# EAGLE design tick-display-mk-4-mini (EAGLE 6.5.0)
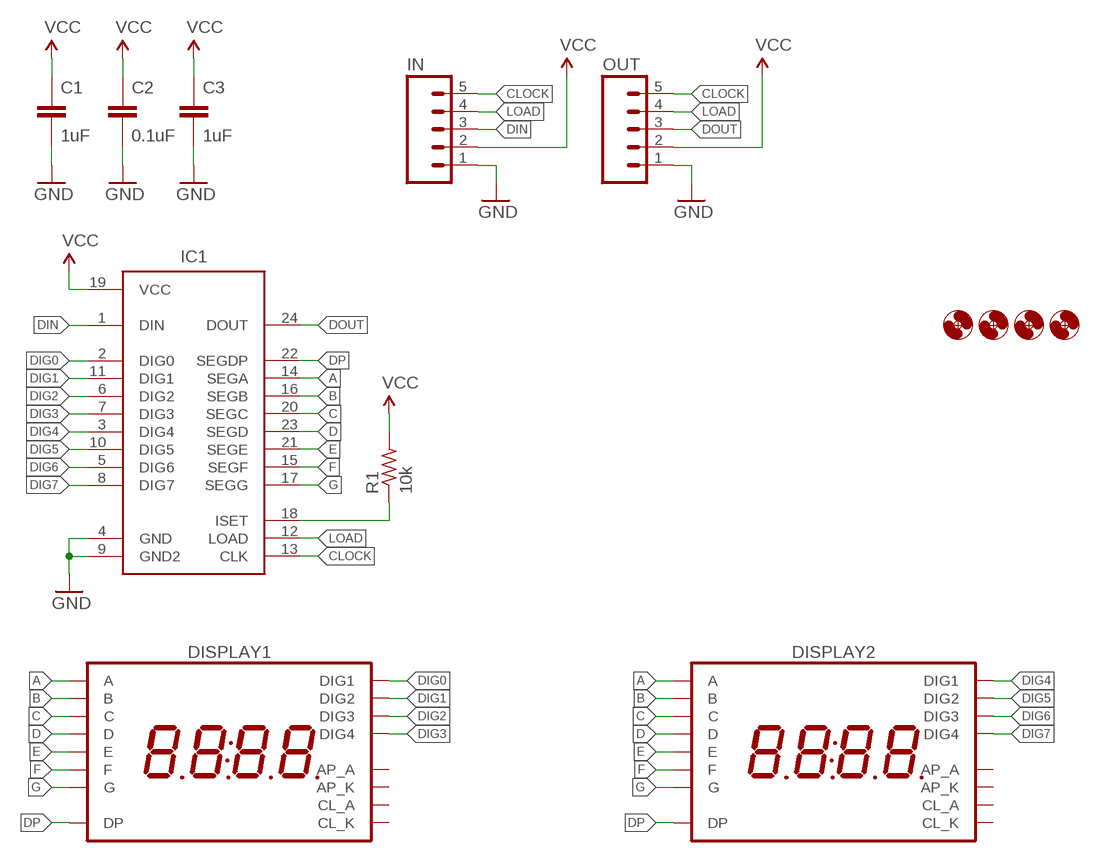
[diagram p0: schematic, sheet 1]

## Parts
C1  1uF  CAPACITOR-CERAMIC025-024X044  [C025-024X044]
C2  0.1uF  CAPACITOR-CERAMIC025-024X044  [C025-024X044]
C3  1uF  CAPACITOR-CERAMIC025-024X044  [C025-024X044]
DISPLAY1  7SEG_4DIGIT_10MM  [7SEG_4DIG_10MM]
DISPLAY2  7SEG_4DIGIT_10MM  [7SEG_4DIG_10MM]
H1  HOLE#2  [HOLE-#2]
H2  HOLE#2  [HOLE-#2]
H3  HOLE#2  [HOLE-#2]
H4  HOLE#2  [HOLE-#2]
IC1  MAX7219DIP  [DIL24]
IN  M05PTH  [1X05]
OUT  M05PTH  [1X05]
R1  10k  RESISTORPTH-AXIAL-7.68MM  [RESISTOR-AXIAL-PTH-7.68MM]

## Nets
A: DISPLAY1.14(A) DISPLAY2.14(A) IC1.14(SEGA)
B: DISPLAY1.16(B) DISPLAY2.16(B) IC1.16(SEGB)
C: DISPLAY1.13(C) DISPLAY2.13(C) IC1.20(SEGC)
CLOCK: IC1.13(CLK) IN.5 OUT.5
D: DISPLAY1.3(D) DISPLAY2.3(D) IC1.23(SEGD)
DIG0: DISPLAY1.1(DIG1) IC1.2(DIG0)
DIG1: DISPLAY1.2(DIG2) IC1.11(DIG1)
DIG2: DISPLAY1.6(DIG3) IC1.6(DIG2)
DIG3: DISPLAY1.8(DIG4) IC1.7(DIG3)
DIG4: DISPLAY2.1(DIG1) IC1.3(DIG4)
DIG5: DISPLAY2.2(DIG2) IC1.10(DIG5)
DIG6: DISPLAY2.6(DIG3) IC1.5(DIG6)
DIG7: DISPLAY2.8(DIG4) IC1.8(DIG7)
DIN: IC1.1(DIN) IN.3
DOUT: IC1.24(DOUT) OUT.3
DP: DISPLAY1.7(DP) DISPLAY2.7(DP) IC1.22(SEGDP)
E: DISPLAY1.5(E) DISPLAY2.5(E) IC1.21(SEGE)
F: DISPLAY1.11(F) DISPLAY2.11(F) IC1.15(SEGF)
G: DISPLAY1.15(G) DISPLAY2.15(G) IC1.17(SEGG)
GND: C1.2 C2.2 C3.2 IC1.4(GND) IC1.9(GND2) IN.1 OUT.1
LOAD: IC1.12(LOAD) IN.4 OUT.4
N$1: IC1.18(ISET) R1.P$1
VCC: C1.1 C2.1 C3.1 IC1.19(VCC) IN.2 OUT.2 R1.P$2
Unconnected: DISPLAY1.4(CL_A) DISPLAY1.9(AP_K) DISPLAY1.10(AP_A) DISPLAY1.12(CL_K) DISPLAY2.4(CL_A) DISPLAY2.9(AP_K) DISPLAY2.10(AP_A) DISPLAY2.12(CL_K)

## Library data of the parts
C1-C3 = A_butts:CAPACITOR-CERAMIC: CAPACITOR, European symbol
DISPLAY1 DISPLAY2 = A_butts:7SEG_4DIGIT_10MM
H1-H4 = A_butts:HOLE: MOUNTING HOLE with drill center marker
IC1 = A_butts:MAX7219: 8-digit, 8-segment LED display driver, serial input
IN OUT = A_butts:M05: Header 5 Standard 5-pin 0.1" header. Use with straight break away headers (SKU : PRT-00116), right angle break away headers (PRT-00553), swiss pins (PRT-00743), machine pins (PRT-00117), and female headers (PRT-00115). Molex polarized connector foot print use with SKU : PRT-08230 with associated crimp pins and housings.
R1 = A_butts:RESISTOR: RESISTOR, American symbol

## Board
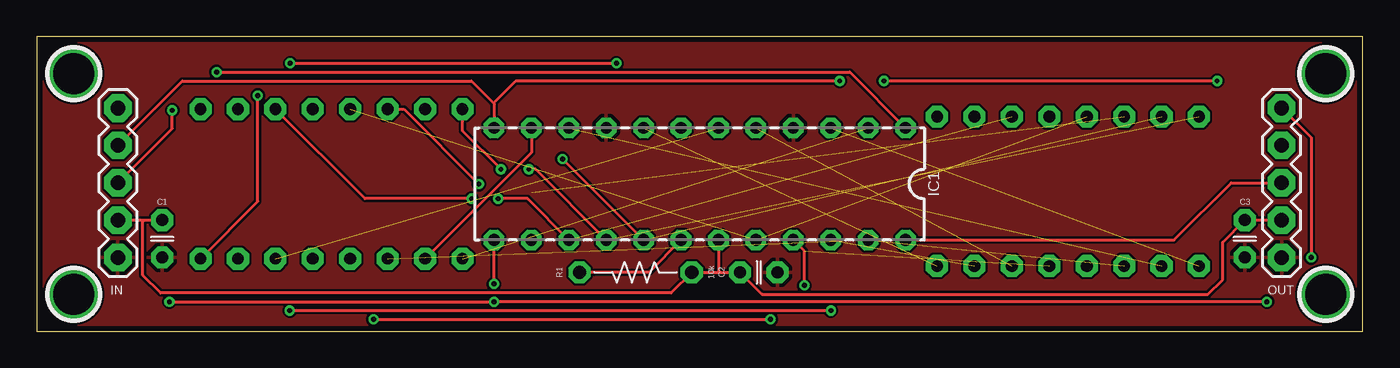
[diagram p1: board, top side]
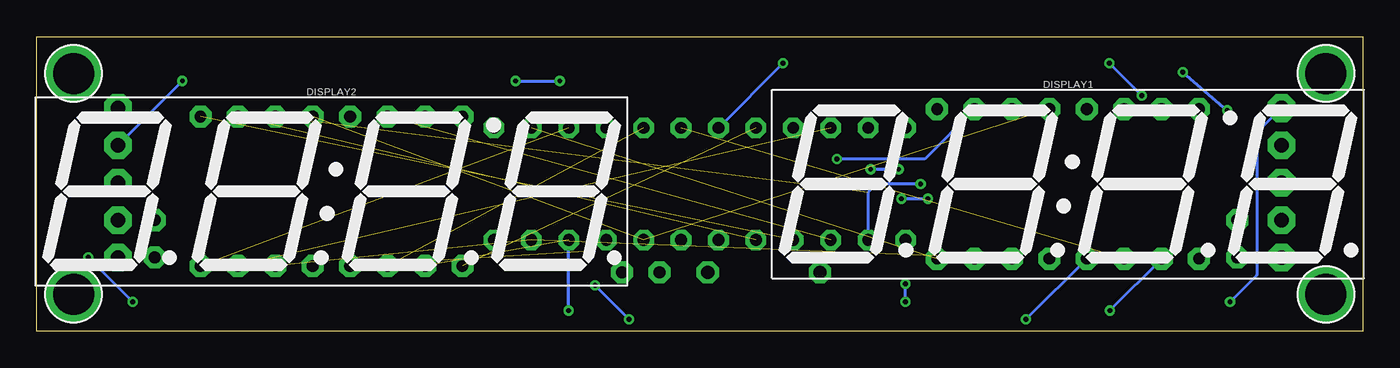
[diagram p2: board, bottom side, seen from below]

Size 90 x 20 mm. Coordinates in mm from the lower left corner, seen from the top.
Outline: 0,0 90,0 90,20 0,20 0,0
Copper layers (1*16): Top 0.0356mm / dielectric 1.5011mm / Bottom 0.0356mm
Design rules "LaenPCBOrder_2": minimum track width 6mil, minimum drill 13mil, track to track 6mil, track to pad 6mil, pad to pad 6mil, via to via 6mil, smd to smd 6mil, copper to edge 15mil, drill to drill 6mil, minimum pad ring 7mil, minimum via ring 7mil, stop-mask expansion 3mil, vias tented up to drill 20mil, thermal gap 10mil

### Footprints (pad centres in the part's own frame; a part is rotated, then mirrored left to right if it is on the bottom)
C025-024X044 = drill 0.813 pad 1.5 octagon: 1 -1.27,0; 2 1.27,0
7SEG_4DIG_10MM = drill 0.8 pad 1.5 octagon: 1 -8.89,-5.08; 2 -6.35,-5.08; 3 -3.81,-5.08; 4 -1.27,-5.08; 5 1.27,-5.08; 6 3.81,-5.08; 7 6.35,-5.08; 8 8.89,-5.08; 9 8.89,5.08; 10 6.35,5.08; 11 3.81,5.08; 12 1.27,5.08; 13 -1.27,5.08; 14 -3.81,5.08; 15 -6.35,5.08; 16 -8.89,5.08
HOLE-#2 = drill 2.8 pad 3.81: P$1 0,0
DIL24 = drill 0.8 pad 1.4 octagon: 1 -13.97,-3.81; 2 -11.43,-3.81; 3 -8.89,-3.81; 4 -6.35,-3.81; 5 -3.81,-3.81; 6 -1.27,-3.81; 7 1.27,-3.81; 8 3.81,-3.81; 9 6.35,-3.81; 10 8.89,-3.81; 11 11.43,-3.81; 12 13.97,-3.81; 13 13.97,3.81; 14 11.43,3.81; 15 8.89,3.81; 16 6.35,3.81; 17 3.81,3.81; 18 1.27,3.81; 19 -1.27,3.81; 20 -3.81,3.81; 21 -6.35,3.81; 22 -8.89,3.81; 23 -11.43,3.81; 24 -13.97,3.81
1X05 = drill 1 pad 1.88 octagon: 1 0,0; 2 2.54,0; 3 5.08,0; 4 7.62,0; 5 10.16,0
RESISTOR-AXIAL-PTH-7.68MM = drill 0.9 pad 1.5 octagon: P$1 -3.81,0; P$2 3.81,0

### Placement (x,y rotation side)
C1  8.5,6.27 270 top
C2  49,4 0 top
C3  82,6.27 270 top
DISPLAY1  20,10 0 bottom
DISPLAY2  70,9.5 0 bottom
H1  2.5,2.5 0 top
H2  2.5,17.5 0 top
H3  87.5,2.5 0 top
H4  87.5,17.5 0 top
IC1  45,10 180 top
IN  5.5,5 90 top
OUT  84.5,5 90 top
R1  40.65,4 0 top

### Tracks (layer width: path | path; a pad name or v marks a point on that pad's centre or on a via)
A  (via drill 0.33)  (1 unrouted)
  Top 0.2: DISPLAY1.14 24.92,15.08 v30,10
  Bottom 0.2: v30,10 33,10 33.57,9.43 IC1.14
B  (via drill 0.33)  (1 unrouted)
  Top 0.2: IC1.16 33.84,11 v33.4,11 | v31.5,11 28.89,13.61 DISPLAY1.16
  Bottom 0.2: v33.4,11 v31.5,11
C  (2 unrouted)
CLOCK  (via drill 0.33)
  Top 0.2: OUT.5 86.5,13.16 v86.5,5 | v83.5,2 v31.03,2 v9,2 | v31.03,3.2 IC1.13
  Bottom 0.2: v86.5,5 v83.5,2 | IN.5 5.54,15.16 7.2,13.5 7.2,3.8 v9,2 | v31.03,2 v31.03,3.2
D  (2 unrouted)
DIG0  (1 unrouted)
DIG1
  Top 0.2: IC1.11 33.57,12.14 DISPLAY1.2
DIG2  (1 unrouted)
DIG3  (via drill 0.33)
  Top 0.2: DISPLAY1.8 15,8.81 v15,16 | v17.2,18.2 v39.34,18.2
  Bottom 0.2: v15,16 v17.2,18.2 | v39.34,18.2 IC1.7
DIG4  (1 unrouted)
DIG5  (1 unrouted)
DIG6  (1 unrouted)
DIG7  (1 unrouted)
DIN  (via drill 0.33)
  Top 0.2: IN.3 9.2,13.78 v9.2,15 | v12.2,17.6 55.18,17.6 IC1.1
  Bottom 0.2: v9.2,15 v12.2,17.6
DOUT
  Top 0.2: IC1.24 77.19,6.19 81.08,10.08 OUT.3
DP  (via drill 0.33)  (1 unrouted)
  Top 0.2: v17.17,1.4 v53.9,1.4
  Bottom 0.2: DISPLAY1.7 v17.17,1.4 | v53.9,1.4 IC1.22
E  (via drill 0.33)  (1 unrouted)
  Top 0.2: v22.85,0.8 v49.8,0.8 | v52.1,3.1 52.1,5.44 IC1.21
  Bottom 0.2: DISPLAY1.5 v22.85,0.8 | v49.8,0.8 v52.1,3.1
F  (via drill 0.33)  (1 unrouted)
  Top 0.2: IC1.15 33.3,9 v31.3,9 | v29.5,9 22.27,9 DISPLAY1.11
  Bottom 0.2: v31.3,9 v29.5,9
G  (via drill 0.33)  (1 unrouted)
  Top 0.2: v35.68,11.7 IC1.17
  Bottom 0.2: DISPLAY1.15 29.73,11.7 v35.68,11.7
GND
  pour Top: 0,0 0,20 90,20 90,0
LOAD  (via drill 0.33)
  Top 0.2: IN.4 9.88,17 29.5,17 31,15.5 | 31,15.5 31.03,15.47 IC1.12 | v80.12,17 v57.5,17 | v54.5,17 32.5,17 31,15.5
  Bottom 0.2: OUT.4 v80.12,17 | v57.5,17 v54.5,17
N$1
  Top 0.2: IC1.18 41.54,4 R1.P$1
VCC
  Top 0.2: 46.27,4 R1.P$2 43.06,2.6 8.4,2.6 7.2,3.8 7.2,7.44 7.3,7.54 | 46.27,4 C2.1 49.23,2.5 79.5,2.5 80.5,3.5 80.5,6.04 C3.1 OUT.2 | IC1.19 46.27,4 | IN.2 7.3,7.54 | 7.3,7.54 C1.1